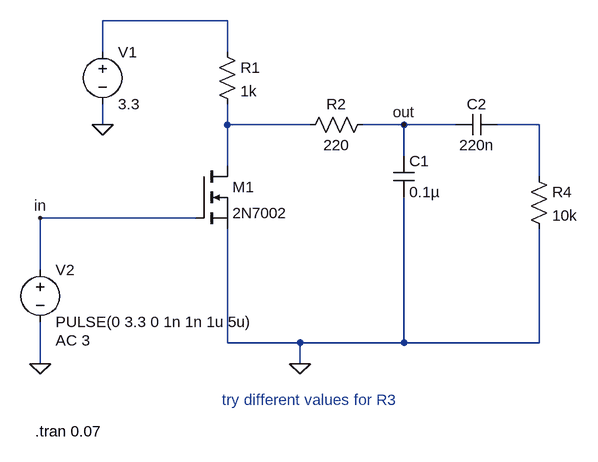
[diagram p0: schematic audio.asc]
audio.asc, the LTspice schematic file:
Version 4
SHEET 1 880 680
WIRE 144 -96 -48 -96
WIRE -48 -48 -48 -96
WIRE 144 -48 144 -96
WIRE -48 64 -48 32
WIRE 144 64 144 32
WIRE 272 64 144 64
WIRE 416 64 352 64
WIRE 496 64 416 64
WIRE 624 64 560 64
WIRE 416 112 416 64
WIRE 144 128 144 64
WIRE 624 144 624 64
WIRE 96 208 -144 208
WIRE -144 288 -144 208
WIRE 144 400 144 224
WIRE 256 400 144 400
WIRE 416 400 416 176
WIRE 416 400 256 400
WIRE 624 400 624 224
WIRE 624 400 416 400
WIRE -144 432 -144 368
WIRE 256 432 256 400
FLAG 256 432 0
FLAG -48 64 0
FLAG -144 432 0
FLAG -144 208 in
FLAG 416 64 out
SYMBOL nmos 96 128 R0
SYMATTR InstName M1
SYMATTR Value 2N7002
SYMBOL res 128 -64 R0
SYMATTR InstName R1
SYMATTR Value 1k
SYMBOL res 368 48 R90
WINDOW 0 0 56 VBottom 2
WINDOW 3 32 56 VTop 2
SYMATTR InstName R2
SYMATTR Value 220
SYMBOL cap 400 112 R0
SYMATTR InstName C1
SYMATTR Value 0.1µ
SYMATTR SpiceLine V=4 Irms=0 Rser=0 Lser=0 mfg="Murata" pn="GRM032R60G104KE15" type="X5R"
SYMBOL voltage -48 -64 R0
WINDOW 123 0 0 Left 0
WINDOW 39 0 0 Left 0
SYMATTR InstName V1
SYMATTR Value 3.3
SYMBOL voltage -144 272 R0
WINDOW 123 24 124 Left 2
WINDOW 39 0 0 Left 0
SYMATTR Value2 AC 3
SYMATTR InstName V2
SYMATTR Value PULSE(0 3.3 0 1n 1n 1u 5u)
SYMBOL res 608 128 R0
SYMATTR InstName R4
SYMATTR Value 10k
SYMBOL cap 560 48 R90
WINDOW 0 0 32 VBottom 2
WINDOW 3 32 32 VTop 2
SYMATTR InstName C2
SYMATTR Value 220n
TEXT -152 536 Left 2 !.tran 0.07
TEXT 136 488 Left 2 ;try different values for R3

The netlist it stands for:
* audio.asc
M1 N002 in 0 0 2N7002
R1 N001 N002 1k
R2 out N002 220
C1 out 0 0.1µ V=4 Irms=0 Rser=0 Lser=0 mfg="Murata" pn="GRM032R60G104KE15" type="X5R"
V1 N001 0 3.3
V2 in 0 PULSE(0 3.3 0 1n 1n 1u 5u) AC 3
R4 N003 0 10k
C2 N003 out 220n
.model NMOS NMOS
.model PMOS PMOS
.lib standard.mos
.tran 0.07
* try different values for R3
.backanno
.end